# EasyEDA Pro project 6024.eprj

# Schematic Schematic1

## Sheets
1 P1: Board Name: Board1; Create Date: 2025-01-05; Page Name: P1; Project Name: 6024; Schematic Name: Schematic1; Update Date: 2025-01-05; Company: EasyEDA.com; Page Size: A4; Version: V1.0
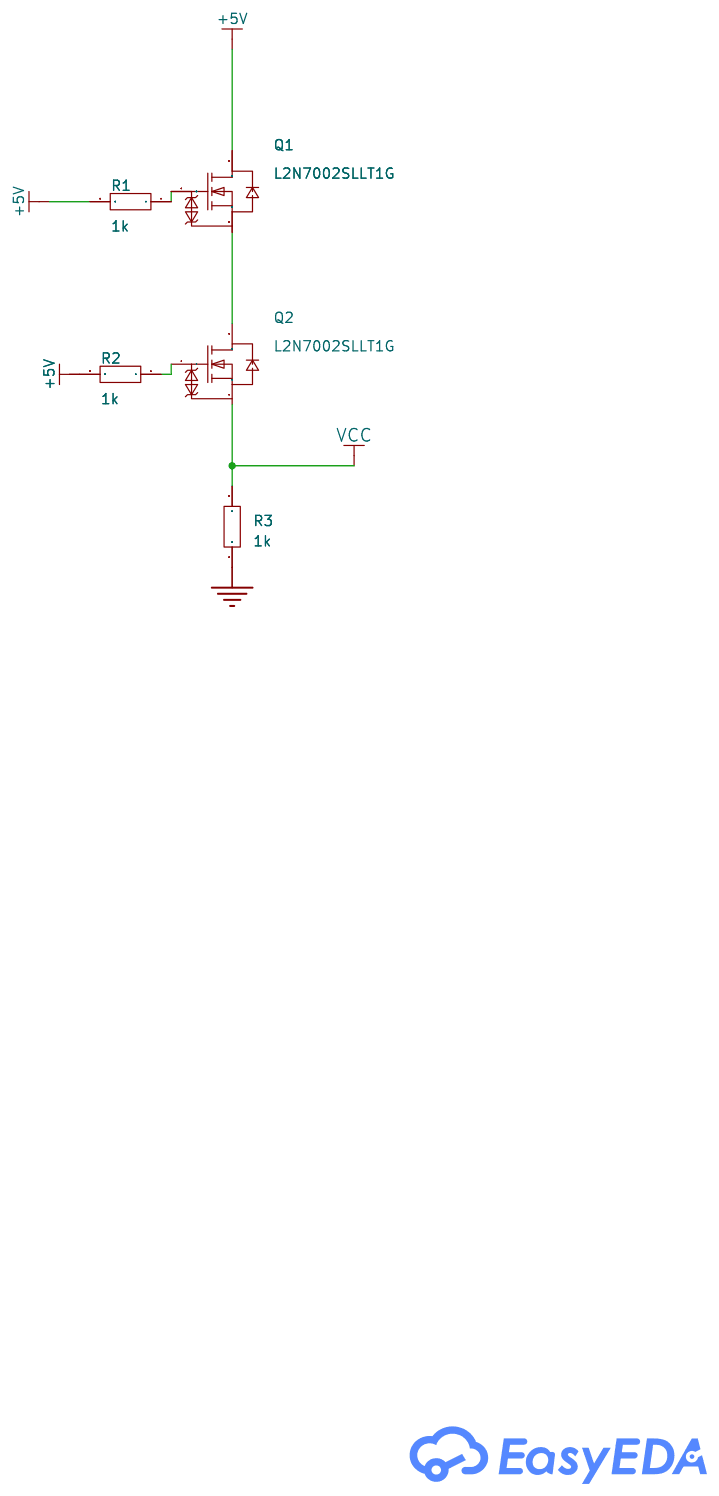
[diagram p0: P1]
2 P2: Create Date: 2025-01-06; Project Name: Project Name; Schematic Name: Schematic Name; Update Date: 2021.11.05
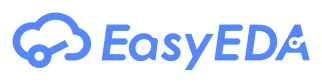
[diagram p1: P2]

## Parts
Q1  L2N7002SLLT1G  [SOT-23-3_L3.0-W1.7-P0.95-LS2.9-BR]
Q2  L2N7002SLLT1G  [SOT-23-3_L3.0-W1.7-P0.95-LS2.9-BR]
R1  10K  [R0603]
R2  10K  [R0603]
R3  10K  [R0603]

## Library data of the parts
Q1 Q2 = L2N7002SLLT1G: Type:1 N-Channel Drain Source Voltage (Vdss):60V Continuous Drain Current (Id): Drain Source On Resistance (RDS(on)@Vgs,Id):2.8Ω@10V,500mA Power Dissipation (Pd): Gate Threshold Voltage (Vgs(th)@Id): Total Gate Charge (Qg@Vgs):440pC@4.5V Input Capacitance; LCSC Part Name: 1个N沟道 耐压:60V 电流:380mA; Supplier Part: C22446827; Manufacturer: LRC(乐山无线电); Supplier Footprint: SOT-23; JLCPCB Part Class: Extended Part; Datasheet: https://atta.szlcsc.com/upload/public/pdf/source/20240529/804683F6F610BC810C43B61F364F3FCA.pdf; Supplier: LCSC; Type: 1 N-Channel; Drain Source Voltage (Vdss): 60V; Drain Source On Resistance (RDS(on)@Vgs,Id): 2.8Ω@10V,500mA; Total Gate Charge (Qg@Vgs): 440pC@4.5V; Input Capacitance (Ciss@Vds): 35pF@25V; Reverse Transfer Capacitance (Crss@Vds): 5pF@25V; Operating Temperature: -55℃~+150℃
R1-R3 = Res_0603: Supplier Footprint: 0603

## Nets
+5V: Q1.3(D) R1.2 R2.2
VCC: Q2.2(S) R3.1 R3.2
Net-(Q1-1): Q1.1(G) R1.1
Net-(Q1-2): Q1.2(S) Q2.3(D)
Net-(Q2-1): Q2.1(G) R2.1
